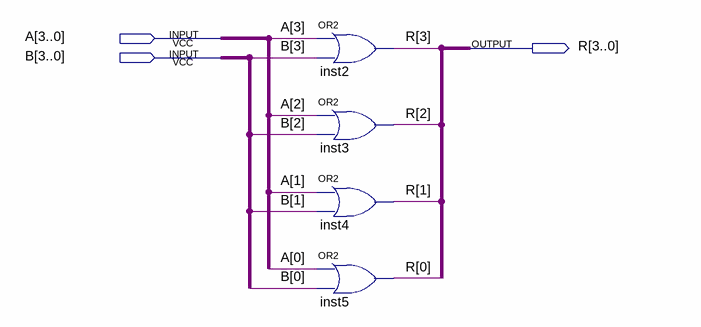
[diagram p0: schematic sheet]
// Quartus schematic OR4b.bdf as structural Verilog: 4 symbols, 3 pins
module OR4b (
  input  [3:0] A,
  input  [3:0] B,
  output [3:0] R
);

  or inst2 (R[3], A[3], B[3]);
  or inst3 (R[2], A[2], B[2]);
  or inst4 (R[1], A[1], B[1]);
  or inst5 (R[0], A[0], B[0]);
endmodule
